# Altium schematic sheet 沙漏最终版.SchDoc
size A4
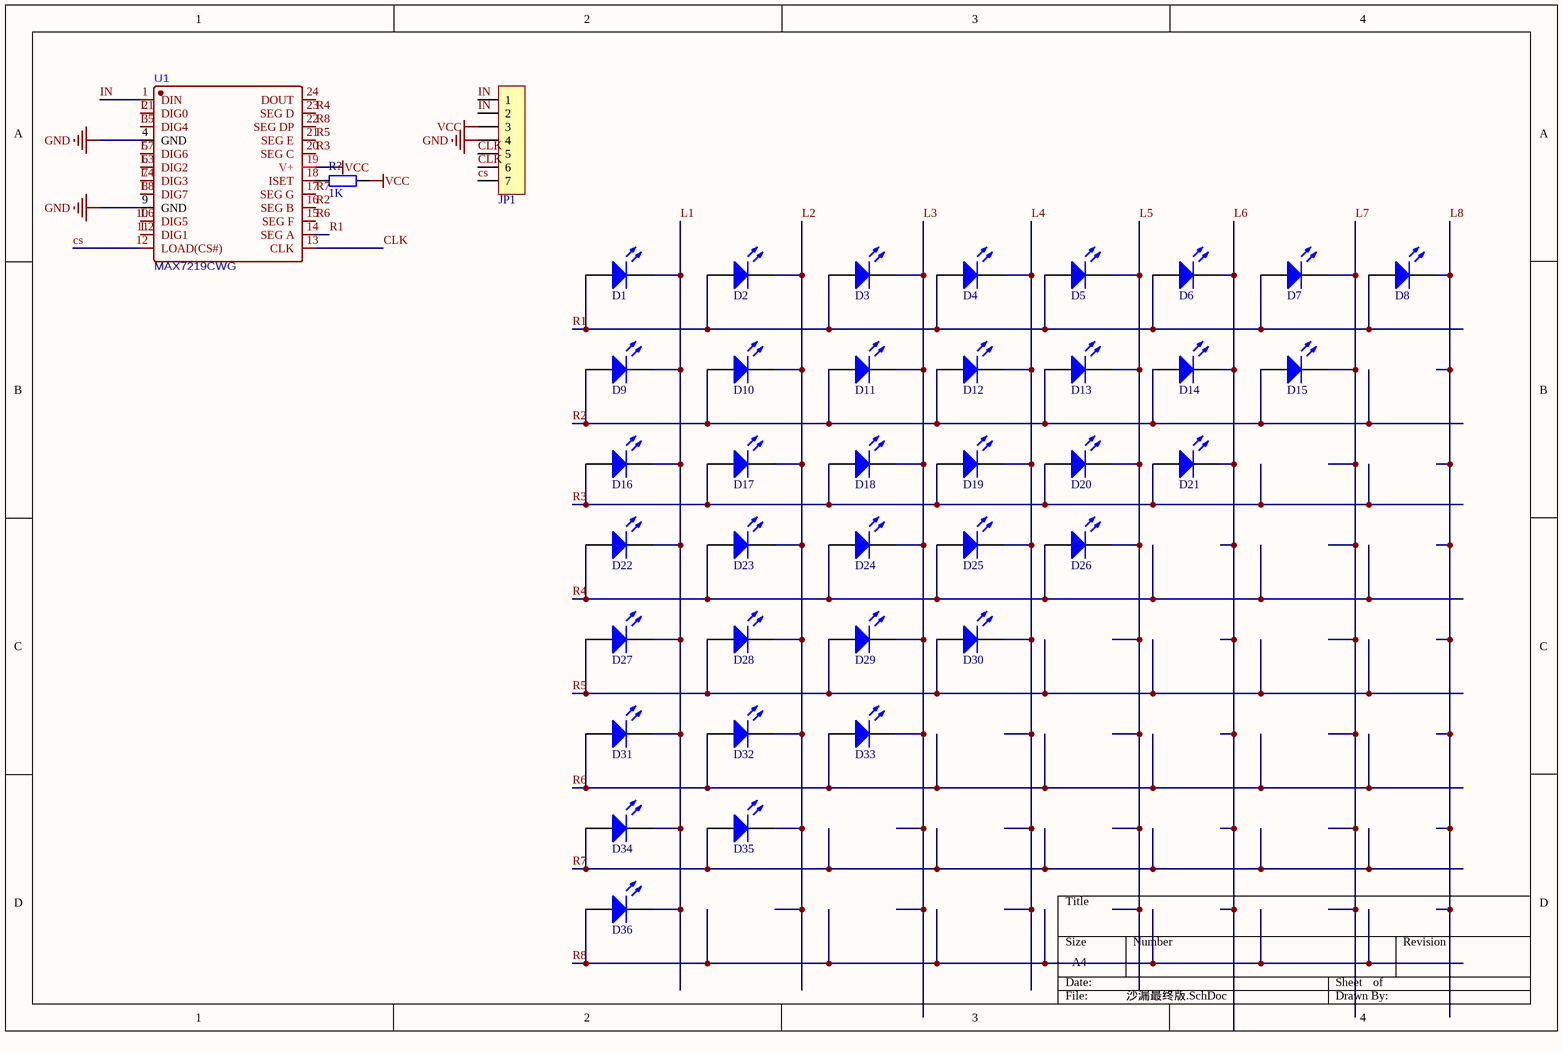
[diagram p0: 沙漏最终版.SchDoc]

## Parts
D1  LED  [LED_A2]  (value not drawn)
D2  LED  [LED_A2]  (value not drawn)
D3  LED  [LED_A2]  (value not drawn)
D4  LED  [LED_A2]  (value not drawn)
D5  LED  [LED_A2]  (value not drawn)
D6  LED  [LED_A2]  (value not drawn)
D7  LED  [LED_A2]  (value not drawn)
D8  LED  [LED_A2]  (value not drawn)
D9  LED  [LED_A2]  (value not drawn)
D10  LED  [LED_A2]  (value not drawn)
D11  LED  [LED_A2]  (value not drawn)
D12  LED  [LED_A2]  (value not drawn)
D13  LED  [LED_A2]  (value not drawn)
D14  LED  [LED_A2]  (value not drawn)
D15  LED  [LED_A2]  (value not drawn)
D16  LED  [LED_A2]  (value not drawn)
D17  LED  [LED_A2]  (value not drawn)
D18  LED  [LED_A2]  (value not drawn)
D19  LED  [LED_A2]  (value not drawn)
D20  LED  [LED_A2]  (value not drawn)
D21  LED  [LED_A2]  (value not drawn)
D22  LED  [LED_A2]  (value not drawn)
D23  LED  [LED_A2]  (value not drawn)
D24  LED  [LED_A2]  (value not drawn)
D25  LED  [LED_A2]  (value not drawn)
D26  LED  [LED_A2]  (value not drawn)
D27  LED  [LED_A2]  (value not drawn)
D28  LED  [LED_A2]  (value not drawn)
D29  LED  [LED_A2]  (value not drawn)
D30  LED  [LED_A2]  (value not drawn)
D31  LED  [LED_A2]  (value not drawn)
D32  LED  [LED_A2]  (value not drawn)
D33  LED  [LED_A2]  (value not drawn)
D34  LED  [LED_A2]  (value not drawn)
D35  LED  [LED_A2]  (value not drawn)
D36  LED  [LED_A2]  (value not drawn)
JP1  HDR-1X7  [HDR2.54-LI-7P]  (value not drawn)
R?  1K  [R 0805_L]
U1  MAX7219CWG  [SOIC-24_L15.4-W7.5-P1.27-LS10.3-BL]

## Nets
GND: JP1.4 U1.4(GND) U1.9(GND)
VCC: JP1.3 R?.2 U1.19(V+)
CLK: JP1.5 JP1.6 U1.13(CLK)
cs: JP1.7 U1.12(LOAD(CS#))
IN: JP1.1 JP1.2 U1.1(DIN)
L1: D1.2(K) D9.2(K) D16.2(K) D22.2(K) D27.2(K) D31.2(K) D34.2(K) D36.2(K) U1.2(DIG0)
L2: D2.2(K) D10.2(K) D17.2(K) D23.2(K) D28.2(K) D32.2(K) D35.2(K) U1.11(DIG1)
L3: D3.2(K) D11.2(K) D18.2(K) D24.2(K) D29.2(K) D33.2(K) U1.6(DIG2)
L4: D4.2(K) D12.2(K) D19.2(K) D25.2(K) D30.2(K) U1.7(DIG3)
L5: D5.2(K) D13.2(K) D20.2(K) D26.2(K) U1.3(DIG4)
L6: D6.2(K) D14.2(K) D21.2(K) U1.10(DIG5)
L7: D7.2(K) D15.2(K) U1.5(DIG6)
L8: D8.2(K) U1.8(DIG7)
R1: D1.1(A) D2.1(A) D3.1(A) D4.1(A) D5.1(A) D6.1(A) D7.1(A) D8.1(A) U1.14(SEG_A)
R2: D9.1(A) D10.1(A) D11.1(A) D12.1(A) D13.1(A) D14.1(A) D15.1(A) U1.16(SEG_B)
R3: D16.1(A) D17.1(A) D18.1(A) D19.1(A) D20.1(A) D21.1(A) U1.20(SEG_C)
R4: D22.1(A) D23.1(A) D24.1(A) D25.1(A) D26.1(A) U1.23(SEG_D)
R5: D27.1(A) D28.1(A) D29.1(A) D30.1(A) U1.21(SEG_E)
R6: D31.1(A) D32.1(A) D33.1(A) U1.15(SEG_F)
R7: D34.1(A) D35.1(A) U1.17(SEG_G)
R8: D36.1(A) U1.22(SEG_DP)
NetR?_1: R?.1 U1.18(ISET)

Not connected (* = marked no-connect by the designer): U1 24(DOUT)

## Library data of the parts
D1-D36 = LED: 发光二极管; Published: 8-Jun-2000; LatestRevisionDate: 08-Jul-2005; LatestRevisionNote: Mech Layer 1 removed.; PackageReference: LED-0; Publisher: Altium Limited
JP1 = Header 7: 7P接插件; 版权归属: 封装库来自淘宝 ID：黄晶宝石; BOM名称: 7P接插件; 学习资源: https://shop463601444.taobao.com
R? = R: 贴片电阻; 版权归属: 来自淘宝 ID：黄晶宝石; BOM名称: 贴片电阻; 联系售后: https://shop463601444.taobao.com